# EAGLE design Gomez_DMF_v1 (EAGLE 9.0.0)
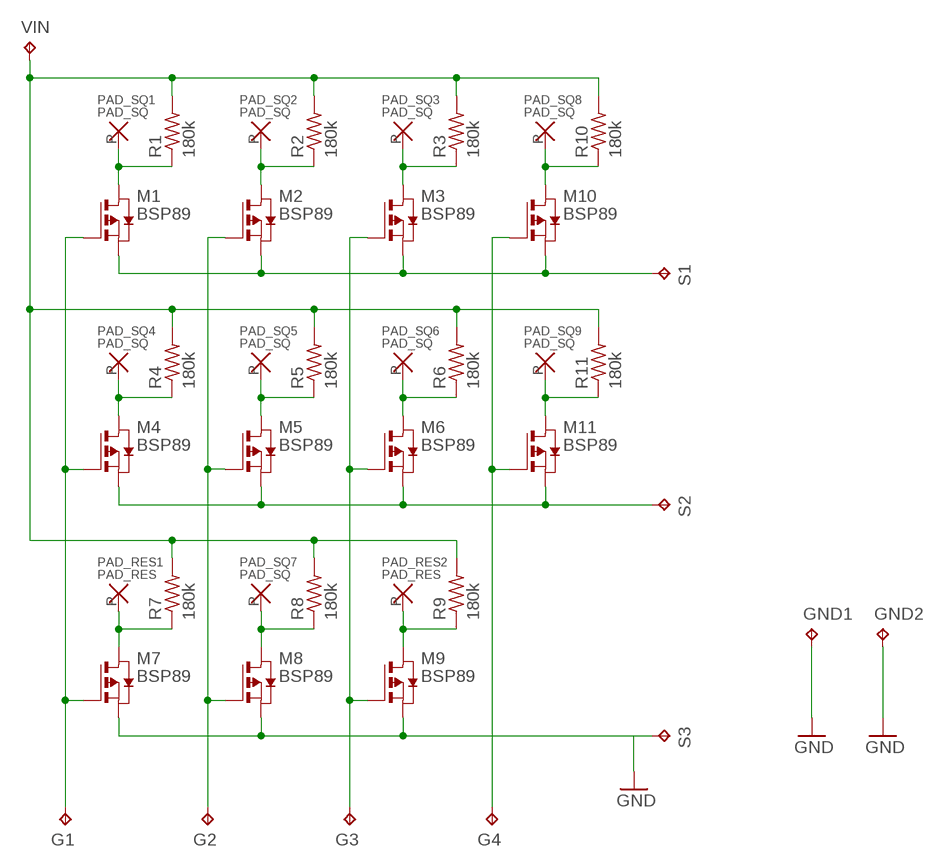
[diagram p0: schematic, sheet 1]

## Parts
G1  TPB2,54  [B2,54]
G2  TPB2,54  [B2,54]
G3  TPB2,54  [B2,54]
G4  TPB2,54  [B2,54]
GND1  TPB2,54  [B2,54]
GND2  TPB2,54  [B2,54]
M1  BSP89  PMOSSOT223  [SOT223]
M2  BSP89  PMOSSOT223  [SOT223]
M3  BSP89  PMOSSOT223  [SOT223]
M4  BSP89  PMOSSOT223  [SOT223]
M5  BSP89  PMOSSOT223  [SOT223]
M6  BSP89  PMOSSOT223  [SOT223]
M7  BSP89  PMOSSOT223  [SOT223]
M8  BSP89  PMOSSOT223  [SOT223]
M9  BSP89  PMOSSOT223  [SOT223]
M10  BSP89  PMOSSOT223  [SOT223]
M11  BSP89  PMOSSOT223  [SOT223]
PAD_RES1  PAD_RES  [PAD_RES]
PAD_RES2  PAD_RES  [PAD_RES]
PAD_SQ1  PAD_SQ  [PAD_SQ]
PAD_SQ2  PAD_SQ  [PAD_SQ]
PAD_SQ3  PAD_SQ  [PAD_SQ]
PAD_SQ4  PAD_SQ  [PAD_SQ]
PAD_SQ5  PAD_SQ  [PAD_SQ]
PAD_SQ6  PAD_SQ  [PAD_SQ]
PAD_SQ7  PAD_SQ  [PAD_SQ]
PAD_SQ8  PAD_SQ  [PAD_SQ]
PAD_SQ9  PAD_SQ  [PAD_SQ]
R1  180k  R-US_V234/12  [V234/12]
R2  180k  R-US_V234/12  [V234/12]
R3  180k  R-US_V234/12  [V234/12]
R4  180k  R-US_V234/12  [V234/12]
R5  180k  R-US_V234/12  [V234/12]
R6  180k  R-US_V234/12  [V234/12]
R7  180k  R-US_V234/12  [V234/12]
R8  180k  R-US_V234/12  [V234/12]
R9  180k  R-US_V234/12  [V234/12]
R10  180k  R-US_V234/12  [V234/12]
R11  180k  R-US_V234/12  [V234/12]
S1  TPB2,54  [B2,54]
S2  TPB2,54  [B2,54]
S3  TPB2,54  [B2,54]
VIN  TPB2,54  [B2,54]

## Nets
GND [gnd]: GND1.TP GND2.TP
N$1 [power]: R1.2 R2.2 R3.2 R4.2 R5.2 R6.2 R7.2 R8.2 R9.2 R10.2 R11.2 VIN.TP
N$2: M7.2(D) M7.4(D) PAD_RES1.P R7.1
N$3: M8.2(D) M8.4(D) PAD_SQ7.P R8.1
N$4: M9.2(D) M9.4(D) PAD_RES2.P R9.1
N$5: M1.2(D) M1.4(D) PAD_SQ1.P R1.1
N$6: M2.2(D) M2.4(D) PAD_SQ2.P R2.1
N$7: M3.2(D) M3.4(D) PAD_SQ3.P R3.1
N$8: M4.2(D) M4.4(D) PAD_SQ4.P R4.1
N$9: M5.2(D) M5.4(D) PAD_SQ5.P R5.1
N$10: M6.2(D) M6.4(D) PAD_SQ6.P R6.1
N$11: M10.2(D) M10.4(D) PAD_SQ8.P R10.1
N$12: M11.2(D) M11.4(D) PAD_SQ9.P R11.1
N$13 [gnd]: M4.3(S) M5.3(S) M6.3(S) M11.3(S) S2.TP
N$14 [gnd]: M1.3(S) M2.3(S) M3.3(S) M10.3(S) S1.TP
N$15: G1.TP M1.1(G) M4.1(G) M7.1(G)
N$16: G2.TP M2.1(G) M5.1(G) M8.1(G)
N$17: G3.TP M3.1(G) M6.1(G) M9.1(G)
N$18 [gnd]: M7.3(S) M8.3(S) M9.3(S) S3.TP
N$19: G4.TP M10.1(G) M11.1(G)

## Library data of the parts
G1-G4 GND1 GND2 S1-S3 VIN = testpad:TP: Test pad
M1-M11 = zetex:PMOSSOT223: MOS FET; OC_FARNELL: unknown; OC_NEWARK: unknown
PAD_RES1 PAD_RES2 = Gomez:PAD_RES
PAD_SQ1-PAD_SQ9 = Gomez:PAD_SQ
R1-R11 = resistor:R-US_: RESISTOR, American symbol

## Net classes
0 default: drill 0.254 mm, clearance 0.254 mm
1 power: drill 0.254 mm, clearance 0.254 mm
2 gnd: drill 0.254 mm, clearance 0.254 mm

## Board
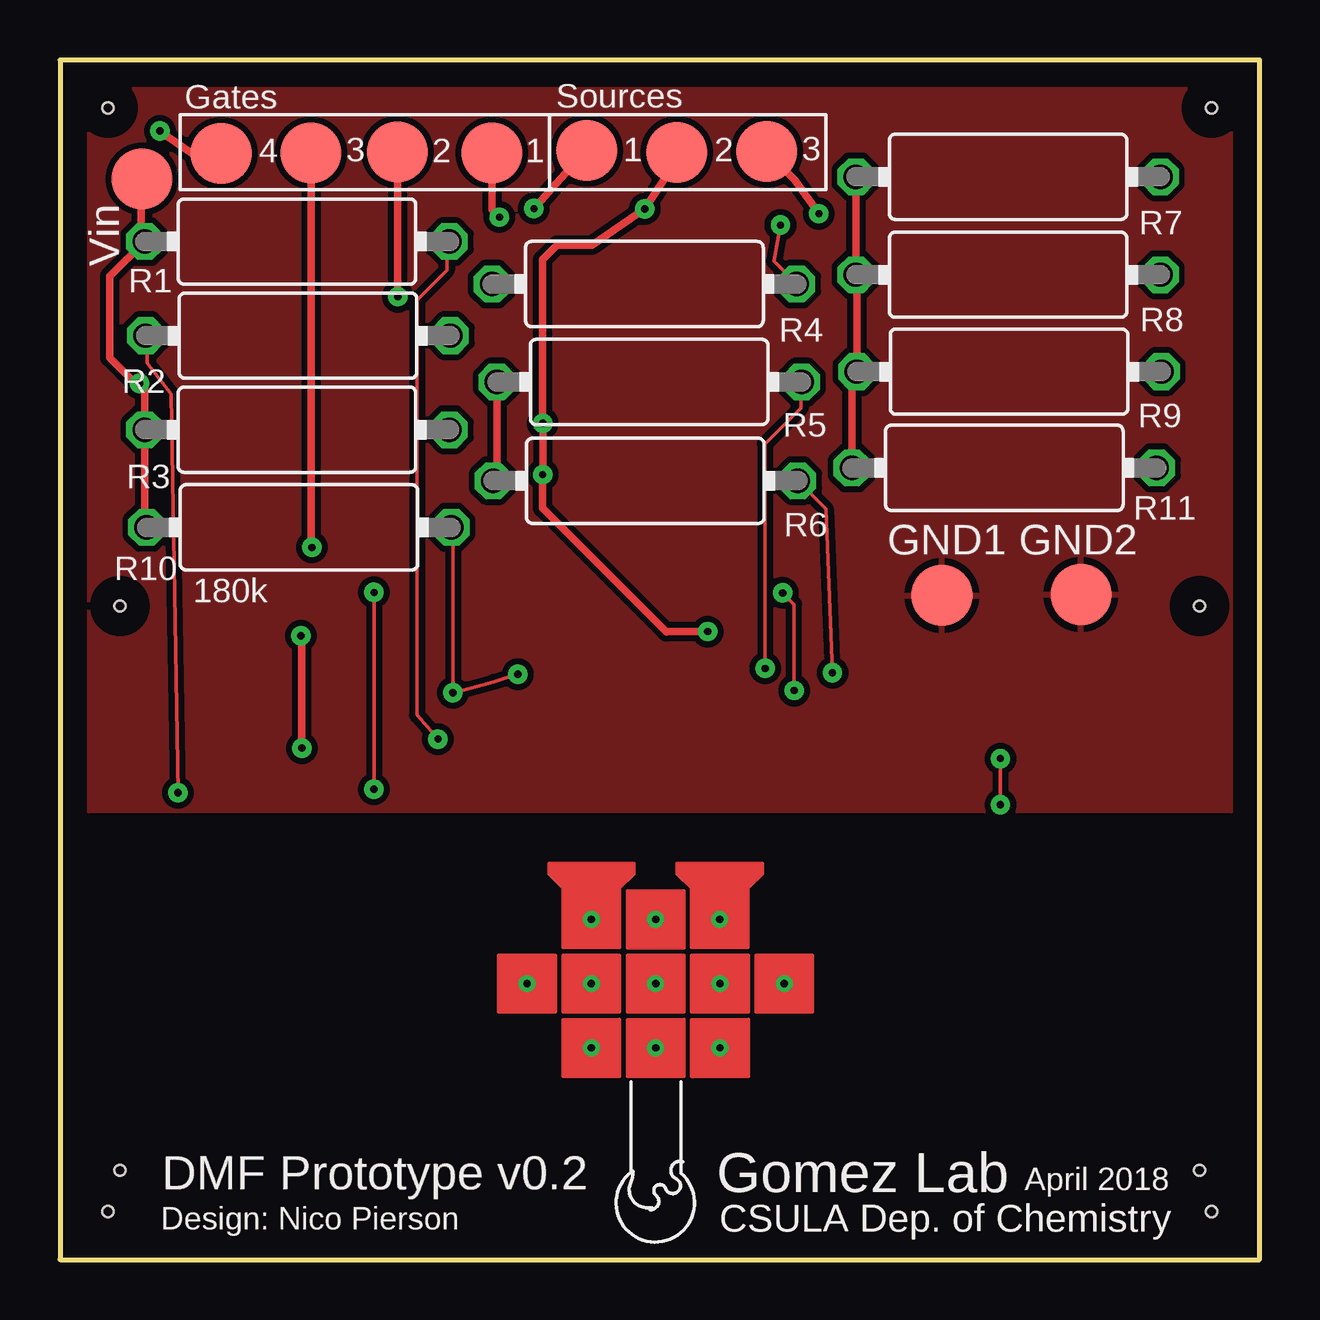
[diagram p1: board, top side]
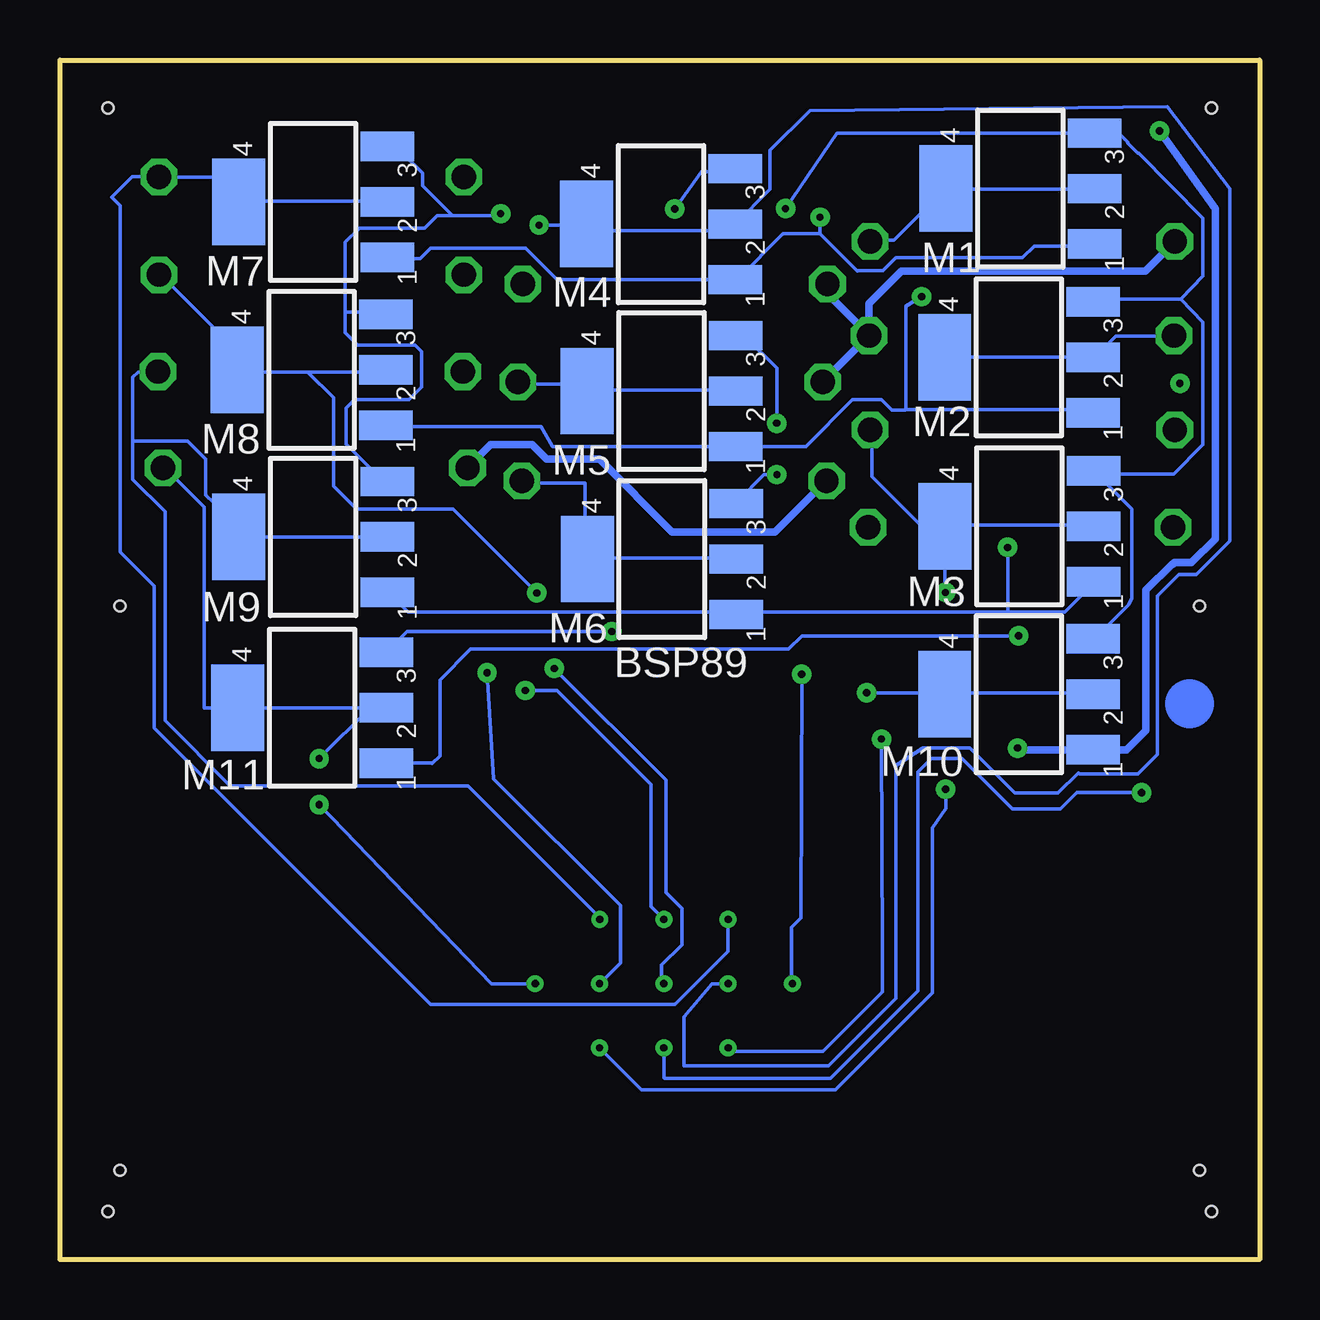
[diagram p2: board, bottom side, seen from below]

Size 50 x 50 mm. Coordinates in mm from the lower left corner, seen from the top.
Outline: 0,0 50,0 50,50 0,50 0,0
Copper layers (1*16): Top 0.035mm / dielectric 1.5mm / Bottom 0.035mm
Design rules "default *": minimum track width 6mil, minimum drill 0.26mm, track to track 10mil, track to pad 10mil, pad to pad 10mil, via to via 10mil, smd to smd 10mil, copper to edge 40mil, drill to drill 10mil, minimum pad ring 8mil, minimum via ring 10mil, stop-mask expansion 4mil, vias tented up to drill 0.3mm, thermal gap 12mil
Holes 0.45 mm at 2.5,3.72 47.5,3.72 48,48 2,48 2.5,27.24 47.5,27.24 2,2 48,2

### Footprints (pad centres in the part's own frame; a part is rotated, then mirrored left to right if it is on the bottom)
B2,54 = smd 2.54 x 2.54: TP 0,0
SOT223 = smd 1.219 x 2.235: 1 -2.311,-3.099; 2 0,-3.099; 3 2.311,-3.099 | smd 3.6 x 2.2: 4 0,3.099
PAD_RES = drill 0.3 pad 0.61: P 0,0
PAD_SQ = drill 0.3 pad 0.61: P 0,0
V234/12 = drill 1.016 octagon: 1 -6.35,0; 2 6.35,0

### Placement (x,y rotation side)
G1  18,46.12 0 top
G2  14.07,46.16 0 top
G3  10.46,46.12 0 top
G4  6.72,46.11 0 top
GND1  36.76,27.68 0 top
GND2  42.56,27.72 0 top
M1  9.97,44.64 90 bottom
M2  10.03,37.6 90 bottom
M3  10.01,30.56 90 bottom
M4  24.95,43.16 90 bottom
M5  24.93,36.2 90 bottom
M6  24.91,29.2 90 bottom
M7  39.45,44.08 90 bottom
M8  39.51,37.08 90 bottom
M9  39.45,30.12 90 bottom
M10  10.03,23.56 90 bottom
M11  39.49,23 90 bottom
PAD_RES1  22.15,14.18 0 top
PAD_RES2  27.5,14.18 0 top
PAD_SQ1  22.15,8.82 0 top
PAD_SQ2  24.83,8.82 0 top
PAD_SQ3  27.51,8.82 0 top
PAD_SQ4  22.15,11.5 0 top
PAD_SQ5  24.83,11.5 0 top
PAD_SQ6  27.51,11.5 0 top
PAD_SQ7  24.83,14.18 0 top
PAD_SQ8  19.47,11.5 0 top
PAD_SQ9  30.19,11.5 0 top
R1  9.88,42.43 180 top
R2  9.92,38.51 0 top
R3  9.88,34.59 180 top
R4  24.36,40.66 180 top
R5  24.56,36.58 180 top
R6  24.4,32.46 180 top
R7  39.52,45.13 180 top
R8  39.52,41.05 180 top
R9  39.56,37.01 180 top
R10  9.96,30.52 180 top
R11  39.36,33 180 top
S1  21.95,46.23 0 top
S2  25.7,46.15 0 top
S3  29.45,46.19 0 top
VIN  3.41,45.04 0 top

### Tracks (layer width: path | path; a pad name or v marks a point on that pad's centre or on a via)
GND
  pour Top: -0.48,50.36 -0.4,18.72 50.44,18.72 50.72,50.36
N$1  (via drill 0.3)
  Top 0.152: 3.62,30.62 3.62,30.57 R10.2 | 3.62,34.5 R3.2 | 3.5,45.12 3.38,45.25 VIN.TP | 3.5,42.5 R1.2
  Top 0.305: VIN.TP 3.37,42.63 3.5,42.5 | R1.2 2.08,40.98 2.08,37.6 3.16,36.52 v3.32,36.52 3.53,36.31 R3.2 3.53,30.66 3.62,30.57 | R5.2 18.21,32.62 R6.2 | R11.2 33.01,36.81 R9.2 33.21,41.01 R8.2 R7.2
  Bottom 0.152: 33.25,37.12 R9.2 | 18,40.62 R4.2 | 3.62,42.38 R1.2
  Bottom 0.305: R1.2 4.76,41.2 14.92,41.2 16.28,39.84 R2.2 | 18,40.62 18,40.24 R2.2 | R2.2 R5.2 | R6.2 20.19,30.32 24.48,30.32 27.52,33.36 29.72,33.36 30.32,33.96 32.05,33.96 R11.2
N$2
  Bottom 0.152: M7.2 36.38,44.12 42.5,44.12 M7.4 42.62,44.12 43.62,45.12 45.75,45.12 R7.1 | R7.1 | R7.1 46.99,45.13 47.84,44.28 47.48,43.92 47.48,29.48 46.08,28.08 46.08,22.16 34.55,10.63 24.36,10.63 22.15,12.85 PAD_RES1.P
N$3  (via drill 0.3)
  Top 0.152: 25.38,14.75 24.88,14.25 PAD_SQ7.P | v30.6,23.72 30.6,27.31 v30.12,27.79
  Bottom 0.152: R8.1 45.75,41 42.62,37.88 42.62,37.12 M8.4 42.5,37 39.68,37 | 39.68,37 36.5,37 M8.2 | PAD_SQ7.P 25.36,14.71 25.36,19.8 29.28,23.72 v30.6,23.72 | v30.12,27.79 33.62,31.28 37.64,31.28 38.6,32.24 38.6,35.92 39.68,37
N$4
  Bottom 0.152: M9.2 36.38,30.12 42.5,30.12 M9.4 | PAD_RES2.P 27.5,14.25 33,19.75 35.14,19.75 42.91,19.75 45.62,22.46 45.62,31.18 46.96,32.52 46.96,34.12 | R9.1 46,37 46.75,37 46.96,36.79 46.96,34.12 | 42.62,30.12 M9.4 | M9.4 43.59,31.16 43.59,31.54 43.92,31.87 43.92,33.36 44.68,34.12 46.96,34.12
N$5  (via drill 0.3)
  Top 0.152: 22.12,8.88 PAD_SQ1.P | R1.1 16.12,42.38 16.12,41.25 14.88,40 14.88,22.7 v15.76,21.69
  Bottom 0.152: M1.2 6.88,44.62 13,44.62 M1.4 13.12,44.62 15.25,42.5 16.12,42.5 R1.1 | v15.76,21.69 15.72,12.88 15.72,11.16 18.2,8.68 22.01,8.68 PAD_SQ1.P
N$6  (via drill 0.3 pad 0.65)
  Top 0.152: R2.1 3.62,38.5 3.62,37.38 4.64,36.08 v4.92,19.46
  Bottom 0.152: 24.75,8.88 24.79,8.85 PAD_SQ2.P 24.83,7.57 24.8,7.56 17.88,7.56 14.24,11.2 14.24,20.32 13.68,20.88 12.4,20.88 10.3,18.78 8.3,18.78 7.62,19.46 v4.92,19.46 | R2.1 3.62,38.5 6,38.5 6.88,37.62 M2.2 7,37.62 13.12,37.62 M2.4
N$7  (via drill 0.3)
  Top 0.152: 26.38,7.62 27.5,8.75 PAD_SQ3.P | v13.09,27.8 13.09,19.81 v13.08,19.6
  Bottom 0.152: M3.4 13.12,30.5 13.42,30.5 | M3.2 7,30.62 13,30.62 M3.4 | R3.1 16.25,34.5 16.16,34.41 16.16,32.64 14.08,30.56 M3.4 | PAD_SQ3.P 25.77,7.08 17.68,7.08 13.64,11.12 13.64,18 13.08,18.8 v13.08,19.6 | M3.4 13.11,27.82 v13.09,27.8
N$8  (via drill 0.3)
  Top 0.152: v30.03,43.12 29.75,41.62 30.62,40.75 R4.1
  Bottom 0.152: v30.03,43.12 28.62,43.12 28.12,43.12 M4.4 28.04,42.88 21.91,42.88 M4.2 | 22.12,11.5 PAD_SQ4.P 22.82,11.5 24,10.12 24,8.08 17.96,8.08 15.16,10.88 15.16,20.6 14.04,21.32 12.08,21.32 10.2,19.44 8.4,19.44 7.56,20.28 7.52,20.24 5.08,20.24 4.26,21.06 4.26,27.66 3.36,28.56 2.64,28.56 1.24,29.96 1.24,44.64 3.85,48.05 18.75,47.89 20.4,46.24 20.4,44.61 M4.2 | 21.75,43.25 M4.2
N$9  (via drill 0.3)
  Top 0.152: R5.1 30.88,36.5 30.88,35.5 29.38,34 29.38,24.66 v29.4,24.64
  Bottom 0.152: M5.2 21.88,36.25 28,36.25 M5.4 28.12,36.25 28.38,36.5 30.88,36.5 R5.1 | 24.88,11.5 PAD_SQ5.P | PAD_SQ5.P | PAD_SQ5.P 24.92,11.58 24.92,12.28 24.08,13.12 24.08,14.64 24.74,15.3 24.74,19.98 v29.4,24.64
N$10  (via drill 0.3)
  Top 0.152: R6.1 31.92,31.29 v32.2,24.46
  Bottom 0.152: M6.2 21.88,29.25 28,29.25 M6.4 28.12,29.25 28.12,32.38 30.75,32.38 R6.1 | 27.62,11.5 PAD_SQ6.P 26.64,12.37 26.64,14.76 31.92,20.04 v32.2,24.46
N$11  (via drill 0.3)
  Top 0.152: 19.38,11.5 PAD_SQ8.P | R10.1 16.38,30.5 v16.38,23.62 18.08,24.08 v19.08,24.4
  Bottom 0.152: M10.2 7,23.62 13.12,23.62 M10.4 13.25,23.62 v16.38,23.62 | v19.08,24.4 19.12,14.24 19.52,13.84 19.52,11.55 PAD_SQ8.P
N$12  (via drill 0.3)
  Top 0.152: 30.25,11.5 PAD_SQ9.P | v39.2,20.88 v39.2,18.96
  Bottom 0.152: M11.2 36.12,23 | R11.1 45.62,33 44,31.38 44,23 M11.4 M11.2 | M11.2 37.08,23 v39.2,20.88 | v39.2,18.96 32.02,11.5 PAD_SQ9.P
N$13  (via drill 0.3)
  Top 0.152: 25.62,46.12 S2.TP
  Top 0.305: 26.79,26.18 v27,26.18 25.3,26.18 25.28,26.16 20.12,31.32 v20.12,32.72 v20.12,32.73 v20.12,34.86 v20.12,34.87 20.12,41.68 20.73,42.28 22.18,42.28 v24.38,43.8 25.62,45.73 25.62,46.12
  Bottom 0.152: M4.3 21.88,45.38 21.91,45.34 23.27,45.34 v24.38,43.8 | M6.3 21.75,31.62 20.66,32.72 v20.12,32.72 | M5.3 21.75,38.5 21.46,38.5 20.12,37.16 v20.12,34.86 | 36.38,25.38 M11.3 35.53,26.18 v27,26.18
  Bottom 0.305: M5.3 21.47,38.51 | 21.33,31.51 M6.3
N$14  (via drill 0.3)
  Top 0.305: S1.TP 20.68,44.84 v19.75,43.8
  Bottom 0.152: 6.88,25.88 M10.3 | M3.3 6.88,32.75 3.57,32.75 2.36,33.96 2.36,37.46 2.36,39.08 3.28,40.04 | M1.3 6.75,46.88 6.55,46.88 | 6.88,40 M2.3 6.8,40.04 3.28,40.04 | 6.88,46.88 M1.3 | 6.8,32.76 M3.3 | M3.3 5.32,31.28 5.32,27.55 5.47,27.29 6.88,25.89 | 3.28,40.04 2.36,41 2.36,43.4 5.03,46.11 5.07,46.11 5.5,46.54 5.5,46.58 5.87,46.95 M1.3 | v19.75,43.8 17.61,46.95 M1.3
  Bottom 0.305: 6.88,25.89 6.88,25.88
N$15  (via drill 0.3)
  Top 0.305: G1.TP 18,43.77 v18.32,43.45
  Bottom 0.152: M1.1 6.88,42.25 9.39,42.25 9.88,41.76 15.16,41.76 15.7,41.22 16.78,41.22 | M4.1 21.75,40.88 19.86,42.76 18.32,42.76 | 36,42.12 36.25,41.88 M7.1 36.3,41.72 35,41.72 34.56,42.16 30.6,42.16 29.29,40.85 M4.1 | 21.88,40.88 M4.1 | 16.76,41.2 16.78,41.22 | 16.78,41.22 18.32,42.76 | 18.32,42.76 v18.32,43.45
N$16  (via drill 0.3)
  Top 0.152: 14.12,46.12 G2.TP
  Top 0.305: G2.TP 14.07,40.15 v14.09,40.13
  Bottom 0.152: 21.75,33.88 M5.1 | M8.1 36.38,34.75 36.35,34.73 33.01,34.73 33,34.72 29.94,34.72 29.47,33.89 28.77,33.89 28.41,33.89 M5.1 | 21.88,34 M5.1 | v14.09,40.13 14.75,39.75 14.75,35.42 | M5.1 21.94,34 | M5.1 18.91,33.89 16.96,35.84 15.76,35.84 15.32,35.4 14.77,35.4 14.75,35.42 | 7.22,35.4 7.12,35.5 7,35.38 M2.1 7.06,35.42 14.75,35.42
N$17  (via drill 0.3)
  Top 0.152: 10.5,46 G3.TP
  Top 0.305: G3.TP 10.46,29.72 v10.5,29.68
  Bottom 0.152: 10.5,27 21.75,27 M6.1 21.88,27 35.5,27 36.31,27.81 M9.1 | 10.5,27 8.12,27 7,28.12 M3.1 | 10.5,27 v10.5,29.68
N$18  (via drill 0.3)
  Top 0.152: 29.5,46.12 S3.TP
  Top 0.305: S3.TP 30.64,44.99 v31.63,43.59
  Bottom 0.152: 36.38,32.5 M9.3 | 36.25,46.38 36.26,46.38 | 36.26,46.38 M7.3 | 36.5,39.5 M8.3 36.38,39.38 36.32,39.38 | 35.64,39.4 35.66,39.38 36.32,39.38 | 36.58,32.5 38.08,34 38.08,35.48 37.72,35.84 35.44,35.84 34.92,36.36 34.92,37.84 35.2,38.12 37.6,38.12 38.12,38.64 38.12,39.48 | v31.63,43.59 31.95,43.52 33.64,43.52 | 33.64,43.52 34.88,44.76 34.88,45.28 35.98,46.38 36.26,46.38 | 33.64,43.52 34.28,43.52 34.8,43 37.52,43 38.12,42.4 38.12,39.48 | 38.12,39.48 36.42,39.48 36.32,39.38
  Bottom 0.305: 37.06,39.5 36.5,39.5 | 36.58,32.5 36.38,32.5
N$19  (via drill 0.3)
  Top 0.152: 5.62,46.5 5.62,46.12 6.62,46.12 G4.TP | 10.08,25.96 v10.04,26
  Top 0.305: G4.TP 5.5,46.11 v4.17,47.04 | v10.08,21.32 10.08,25.96
  Bottom 0.152: 35.88,21.25 36.38,20.75 M11.1 34.49,20.69 34.48,20.68 34.16,21 34.16,24.16 32.88,25.44 19.64,25.44 19.08,26 v10.04,26 | 7,21.25 M10.1 6.88,21.25
  Bottom 0.305: v4.17,47.04 1.84,43.8 1.84,30.04 2.84,29.04 3.56,29.04 3.6,29 3.64,29 4.74,27.9 4.74,22.06 5.55,21.25 6.88,21.25 | M10.1 10.01,21.25 v10.08,21.32
(copper drawn outside any net)
  shapes: Bottom circle x1

### Text on the board
tNames: Gates | Sources | 4 | 3 | 2 | 1 | 1 | 2 | 3 | Vin | DMF Prototype v0.2 | Gomez Lab | April 2018 | Design: Nico Pierson | CSULA Dep. of Chemistry